# Altium schematic sheet [10] - POWER.SchDoc: POWER
size A4; Organization: Bjørn T. Brodtkorb; Address1: Frode Rinnans veg 161; Address2: 7050 Trondheim; DocumentNumber: 6598; Revision: 1.0; SheetNumber: 1; SheetTotal: 1
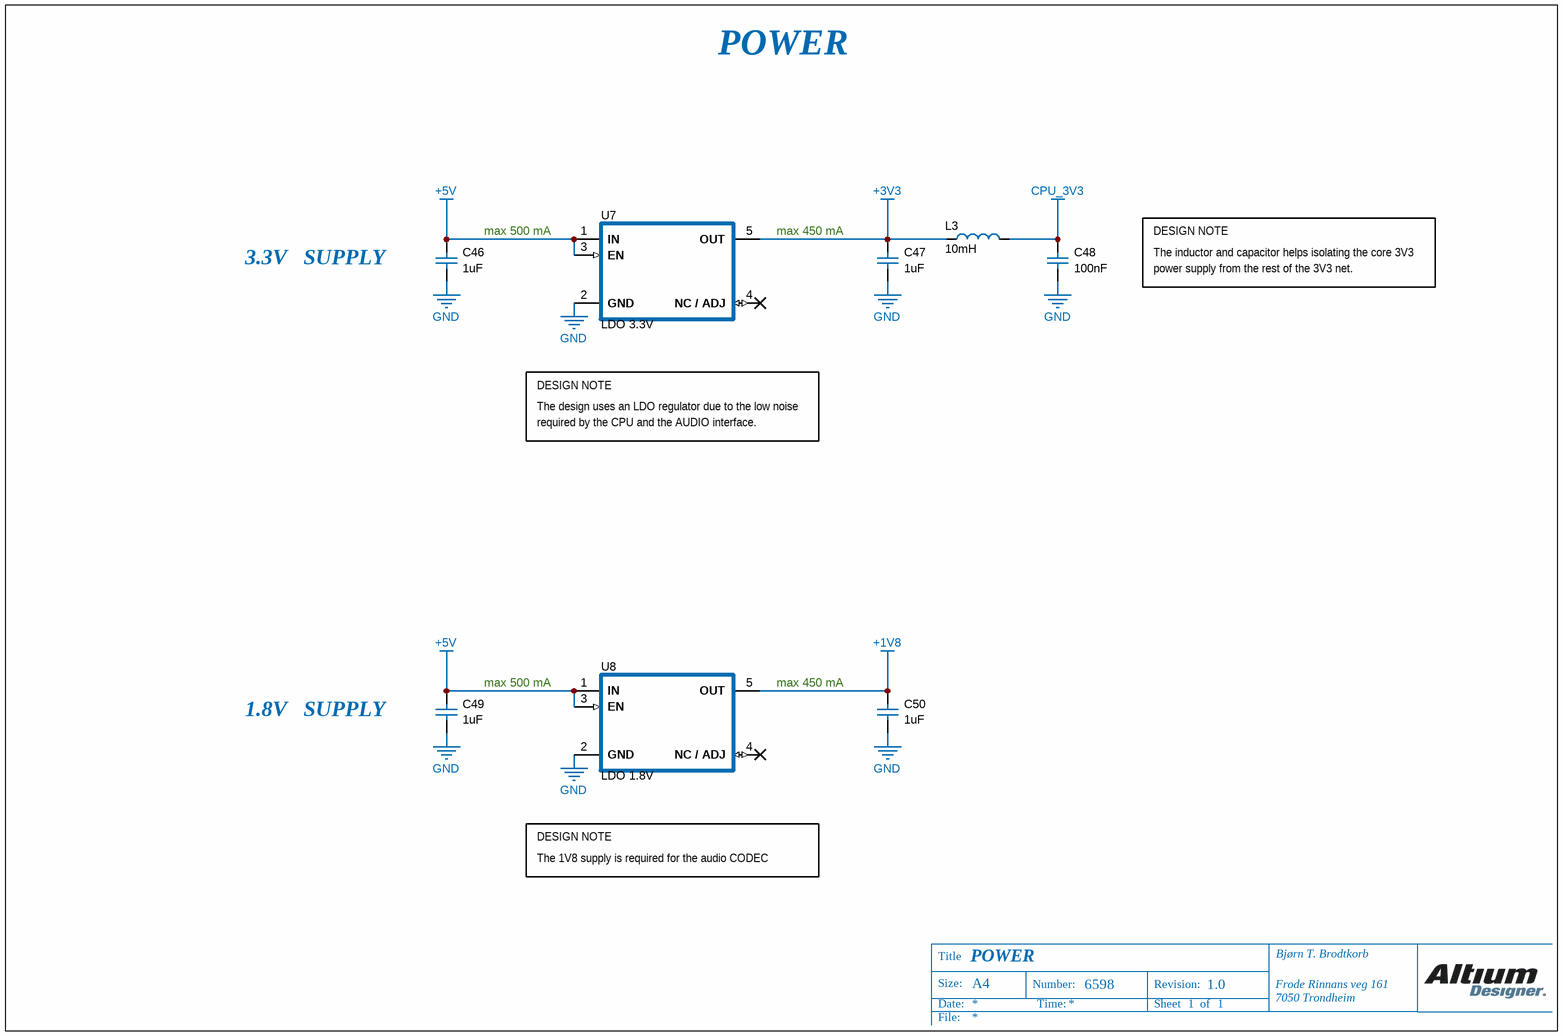
[diagram p0: [10] - POWER.SchDoc]

## Parts
C46  value 1uF  [C0805]  (hidden comment: 08053C105KAT2A)
C47  value 1uF  [C0805]  (hidden comment: 08053C105KAT2A)
C48  value 100nF  [C0603]  (hidden comment: 02016D104KAT2A)
C49  value 1uF  [C0805]  (hidden comment: 08053C105KAT2A)
C50  value 1uF  [C0805]  (hidden comment: 08053C105KAT2A)
L3  value 10mH  [Inductor 0603]  (hidden comment: MLZ1608A2R2WT)
U7  LDO 3.3V  [NCV8161BSN330T1G]
U8  LDO 1.8V  [SOT95P275X110-5N]

## Nets
+1V8: C50.2 U8.5(OUT)
+3V3: C47.2 L3.1 U7.5(OUT)
+5V: C46.2 C49.2 U7.1(IN) U7.3(EN) U8.1(IN) U8.3(EN)
CPU_3V3: C48.2 L3.2
GND: C46.1 C47.1 C48.1 C49.1 C50.1 U7.2(GND) U8.2(GND)

Not connected (* = marked no-connect by the designer): U7 4(NC_/_ADJ)*; U8 4(NC_/_ADJ)*

## Notes on the sheet
- POWER
- max 500 mA
- max 450 mA
- DESIGN NOTE
- 3.3V   SUPPLY
- The inductor and capacitor helps isolating the core 3V3
- power supply from the rest of the 3V3 net.
- The design uses an LDO regulator due to the low noise
- required by the CPU and the AUDIO interface.
- 1.8V   SUPPLY
- The 1V8 supply is required for the audio CODEC
- Title
- Size:
- A4
- Number:
- Revision:
- Date:
- File:
- Time:
- Sheet
- of

## Library data of the parts
C46 C47 C49 C50 = 08053C105KAT2A: C0805
C48 = 02016D104KAT2A: C0603
L3 = MLZ1608A2R2WT: Inductor 0603
U7 = NCV8161BSN330T1G: LDO fixed 3.3V 450mA ultra-low noise; RMS noise: < 100 uVrms; Dropout voltage: 330mV; Supplier Part Number 1: 2775470; Supplier 1: Farnell; Output voltage: 3.3V; Output current: 450mA
U8 = NCV8161ASN180T1G: LDO fixed 1.8V 450mA ultra-low noise; Dropout voltage: 200mV; Supplier 1: Farnell; Output voltage: 1.8V; Supplier Part Number 1: 2775471; Output current: 450mA